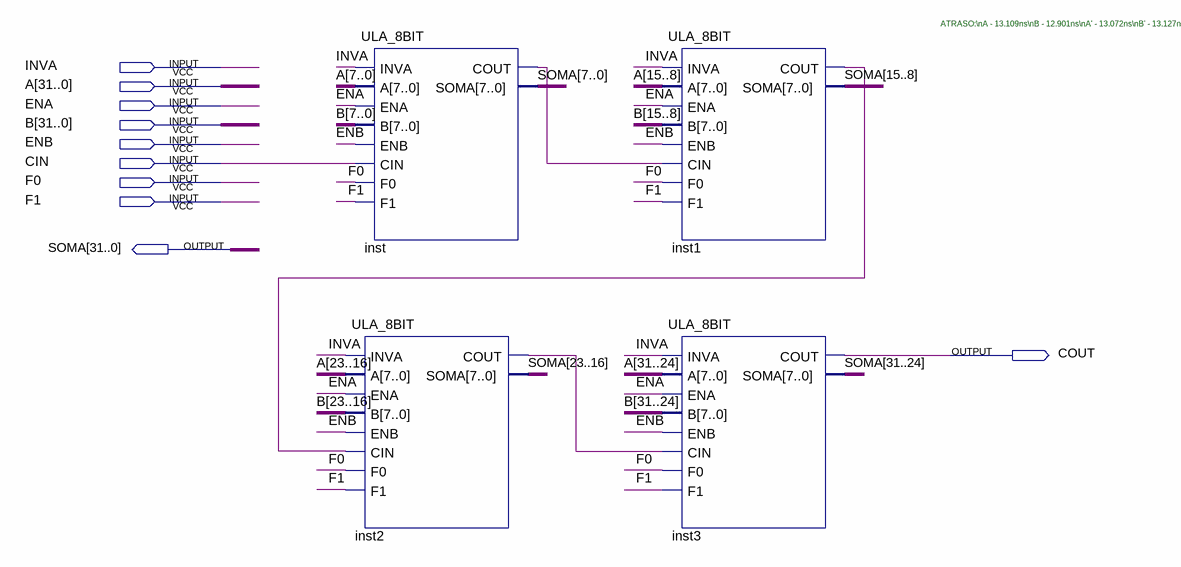
[diagram p0: schematic sheet]
// Quartus schematic ULA_32BIT.bdf as structural Verilog: 4 symbols, 10 pins
module ULA_32BIT (
  input  INVA,
  input  [31:0] A,
  input  ENA,
  input  [31:0] B,
  input  ENB,
  input  CIN,
  input  F0,
  input  F1,
  output [31:0] SOMA,
  output COUT
);

  wire inst1_cout, inst2_cout, inst_cout;

  ULA_8BIT inst (
    .INVA(INVA), .A(A[7:0]), .ENA(ENA), .B(B[7:0]), .ENB(ENB), .CIN(CIN), .F0(F0), .F1(F1), .COUT(inst_cout),
    .SOMA(SOMA[7:0]));
  ULA_8BIT inst2 (
    .INVA(INVA), .A(A[23:16]), .ENA(ENA), .B(B[23:16]), .ENB(ENB), .CIN(inst1_cout), .F0(F0), .F1(F1),
    .COUT(inst2_cout), .SOMA(SOMA[23:16]));
  ULA_8BIT inst1 (
    .INVA(INVA), .A(A[15:8]), .ENA(ENA), .B(B[15:8]), .ENB(ENB), .CIN(inst_cout), .F0(F0), .F1(F1),
    .COUT(inst1_cout), .SOMA(SOMA[15:8]));
  ULA_8BIT inst3 (
    .INVA(INVA), .A(A[31:24]), .ENA(ENA), .B(B[31:24]), .ENB(ENB), .CIN(inst2_cout), .F0(F0), .F1(F1),
    .COUT(COUT), .SOMA(SOMA[31:24]));

  // Notes on the sheet:
  //   ATRASO:\nA - 13.109ns\nB - 12.901ns\nA' - 13.072ns\nB' - 13.127ns\nA+B - 21.932ns\nA+B+1 - 17.237ns\nA+1 - 18.761ns\nB+1 - 18.803ns\nB-A - 20.331ns\nB-1 - 17.445ns\n-A - 19.754ns\nAND -14.788ns\nOR - 14.342ns\n0 - 17.298ns\n1 - 16.052ns\n-1 - 20.772ns
endmodule
